# EAGLE schematic vindriktning (EAGLE 9.6.2)
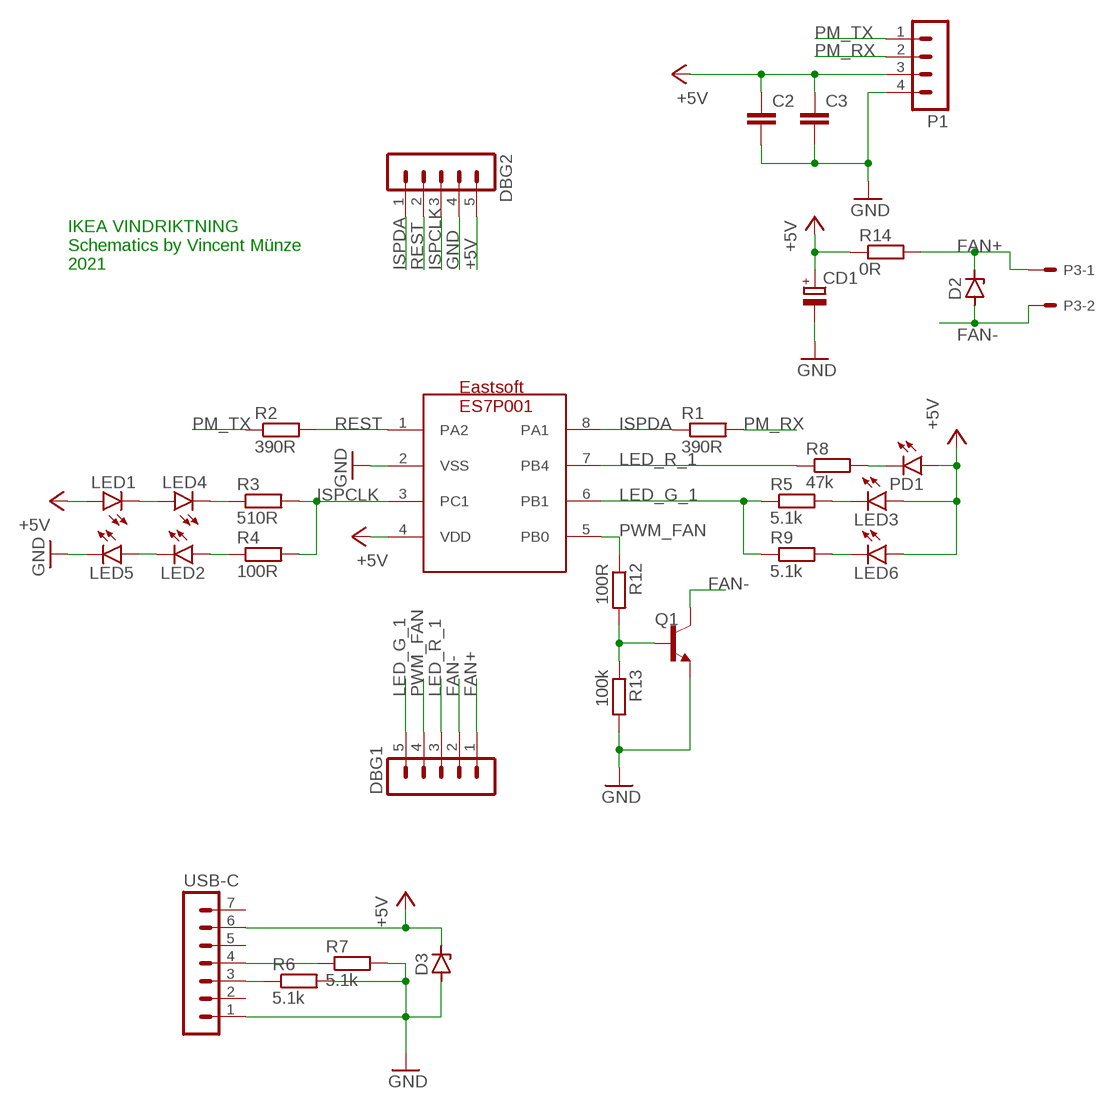
[diagram p0: schematic, sheet 1]

## Parts
C2  C-EU050-024X044  [C050-024X044]
C3  C-EU050-024X044  [C050-024X044]
CD1  CPOL-EU140CLH-0810  [140CLH-0810]
D2  ZENER-DIODESMB  [SMB]
D3  ZENER-DIODESMB  [SMB]
DBG1  MA05-1  [MA05-1]
DBG2  MA05-1  [MA05-1]
LED1  LEDCHIPLED_0603  [CHIPLED_0603]
LED2  LEDCHIPLED_0603  [CHIPLED_0603]
LED3  LEDCHIPLED_0603  [CHIPLED_0603]
LED4  LEDCHIPLED_0603  [CHIPLED_0603]
LED5  LEDCHIPLED_0603  [CHIPLED_0603]
LED6  LEDCHIPLED_0603  [CHIPLED_0603]
P1  MA04-1  [MA04-1]
P3  22-05-7028-02  [7395-02]
PD1  LEDCHIPLED_0603  [CHIPLED_0603]
Q1  BC847C-NPN-SOT23-BEC  [SOT23-BEC]
R1  390R  R-EU_R0603  [R0603]
R2  390R  R-EU_R0603  [R0603]
R3  510R  R-EU_R0603  [R0603]
R4  100R  R-EU_R0603  [R0603]
R5  5.1k  R-EU_R0603  [R0603]
R6  5.1k  R-EU_R0603  [R0603]
R7  5.1k  R-EU_R0603  [R0603]
R8  47k  R-EU_R0603  [R0603]
R9  5.1k  R-EU_R0603  [R0603]
R12  100R  R-EU_R0603  [R0603]
R13  100k  R-EU_R0603  [R0603]
R14  0R  R-EU_R0603  [R0603]
U1  ES7P001  [SOP8]
USB-C  MA07-1  [MA07-1]

## Nets
+5V: C2.1 C3.1 D3.C DBG2.5 LED1.A LED3.A LED6.A P1.3 PD1.A U1.4(VDD) USB-C.6
FAN+: D2.C DBG1.1 P3.1 R14.2
FAN-: D2.A DBG1.2 P3.2 Q1.C
GND: C2.2 C3.2 CD1.- D3.A DBG2.4 LED5.C P1.4 Q1.E R6.2 R7.2 R13.2 U1.2(VSS) USB-C.1
ISPCLK: DBG2.3 R3.2 R4.2 U1.3(PC1)
ISPDA: DBG2.1 R1.1 U1.8(PA1)
LED_G_1: DBG1.5 R5.1 R9.1 U1.6(PB1)
LED_R_1: DBG1.3 R8.1 U1.7(PB4)
N$1: LED4.C R3.1
N$3: LED1.C LED4.A
N$4: PD1.C R8.2
N$5: LED3.C R5.2
N$6: LED6.C R9.2
N$8: R6.1 USB-C.3
N$9: Q1.B R12.2 R13.1
N$11: LED2.A R4.1
N$13: LED2.C LED5.A
N$14: R7.1 USB-C.4
N$15: CD1.+ R14.1 ; supply symbol labelled +5V
PM_RX: P1.2 R1.2
PM_TX: P1.1 R2.1
PWM_FAN: DBG1.4 R12.1 U1.5(PB0)
REST: DBG2.2 R2.2 U1.1(PA2)
Unconnected: USB-C.2 USB-C.5 USB-C.7

## Notes on the sheet
- IKEA VINDRIKTNING
  Schematics by Vincent Münze
  2021

## Library data of the parts
C2 C3 = rcl:C-EU: CAPACITOR, European symbol; SPICEPREFIX: C
CD1 = rcl:CPOL-EU: POLARIZED CAPACITOR, European symbol; SPICEPREFIX: C
D2 D3 = diode:ZENER-DIODE: Z-Diode
DBG1 DBG2 = con-lstb:MA05-1: PIN HEADER; OC_FARNELL: unknown; OC_NEWARK: unknown
LED1-LED6 PD1 = led:LED: LED OSRAM: - CHIPLED LG R971, LG N971, LY N971, LG Q971, LY Q971, LO R971, LY R971 LH N974, LH R974 LS Q976, LO Q976, LY Q976 LO Q996 - Hyper CHIPLED LW Q18S LB Q993, LB Q99A, LB R99A - SideLED LS A670, LO A670, LY A670, LG A670, LP A670 LB A673, LV A673, LT A673, LW A673 LH A674 LY A675 LS A676, LA A676, LO A676, LY A676, LW A676 LS A679, LY A679, LG A679 - Hyper Micro SIDELED® LS Y876, LA Y876, LO Y876, LY Y876 LT Y87S - SmartLED LW L88C, LW L88S LB L89C, LB L89S, LG L890 LS L89K, LO L89K, LY L89K LS L896, LA L896, LO L896, LY L896 - TOPLED LS T670, LO T670, LY T670, LG T670, LP T670 LSG T670, LSP T670, LSY T670, LOP T670, LYG T670 LG T671, LOG T671, LSG T671 LB T673, LV T673, LT T673, LW T673 LH T674 LS T676, LA T676, LO T676, LY T676, LB T676, LH T676, LSB T676, LW T676 LB T67C, LV T67C, LT T67C, LS T67K, LO T67K, LY T67K, LW E67C LS E67B, LA E67B, LO E67B, LY E67B, LB E67C, LV E67C, LT E67C LW T67C LS T679, LY T679, LG T679 LS T770, LO T770, LY T770, LG T770, LP T770 LB T773, LV T773, LT T773, LW T773 LH T774 LS E675, LA E675, LY E675, LS T675 LS T776, LA T776, LO T776, LY T776, LB T776 LHGB T686 LT T68C, LB T68C - Hyper Mini TOPLED® LB M676 - Mini TOPLED Santana® LG M470 LS M47K, LO M47K, LY M47K Source: http://www.osram.convergy.de LUXEON: - LUMILED® LXK2-PW12-R00, LXK2-PW12-S00, LXK2-PW14-U00, LXK2-PW14-V00 LXK2-PM12-R00, LXK2-PM12-S00, LXK2-PM14-U00 LXK2-PE12-Q00, LXK2-PE12-R00, LXK2-PE12-S00, LXK2-PE14-T00, LXK2-PE14-U00 LXK2-PB12-K00, LXK2-PB12-L00, LXK2-PB12-M00, LXK2-PB14-N00, LXK2-PB14-P00, LXK2-PB14-Q00 LXK2-PR12-L00, LXK2-PR12-M00, LXK2-PR14-Q00, LXK2-PR14-R00 LXK2-PD12-Q00, LXK2-PD12-R00, LXK2-PD12-S00 LXK2-PH12-R00, LXK2-PH12-S00 LXK2-PL12-P00, LXK2-PL12-Q00, LXK2-PL12-R00 Source: www.luxeon.com KINGBRIGHT: KA-3528ASYC Source: www.kingbright.com
P1 = con-lstb:MA04-1: PIN HEADER; OC_FARNELL: unknown; OC_NEWARK: unknown
P3 = con-molex:22-?-02: CONNECTOR wire to board 2.54 mm (.1 inch) pitch header; MF: MOLEX; OC_FARNELL: 9731601; OC_NEWARK: unknown
Q1 = transistor:*-NPN-: NPN Transistror BF959 corrected 2008.03.06
R1-R9 R12-R14 = rcl:R-EU_: RESISTOR, European symbol; SPICEPREFIX: R
U1 = Eastsoft:ES7P001
USB-C = con-lstb:MA07-1: PIN HEADER; OC_FARNELL: unknown; OC_NEWARK: unknown